# Altium schematic sheet main.SchDoc
size A4; SheetNumber: 1; SheetTotal: 4
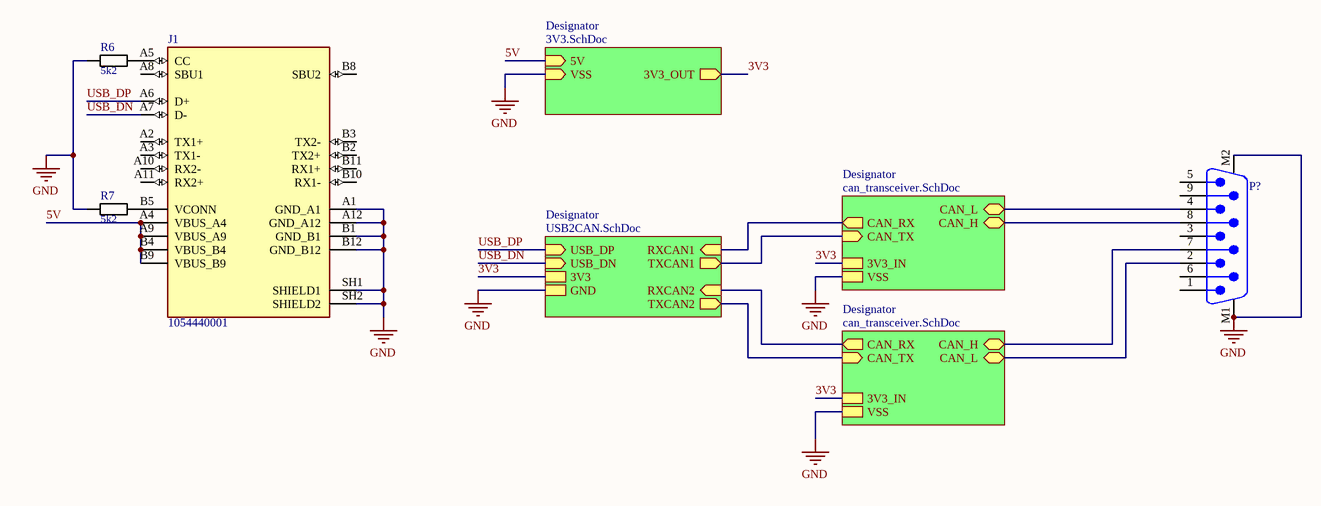
[diagram p0: main.SchDoc]

## Parts
J1  1054440001  [MOLEX_1054440001]
P?  618009211721  [618009211721]  (value not drawn)
R6  5k2  [0603_R]
R7  5k2  [0603_R]

## Sub-sheets
Designator = 3V3.SchDoc: VSS (in), 5V (in), 3V3_OUT (out)
Designator = USB2CAN.SchDoc: USB_DP (in), USB_DN (in), 3V3, GND, RXCAN1 (in), TXCAN1 (out), RXCAN2 (in), TXCAN2 (out)
Designator = can_transceiver.SchDoc: CAN_H (bidir), CAN_L (bidir), CAN_TX (in), CAN_RX (out), 3V3_IN, VSS
Designator = can_transceiver.SchDoc: CAN_H (bidir), CAN_L (bidir), CAN_TX (in), CAN_RX (out), 3V3_IN, VSS

## Nets
GND: J1.A1(GND_A1) J1.A12(GND_A12) J1.B1(GND_B1) J1.B12(GND_B12) J1.SH1(SHIELD1) J1.SH2(SHIELD2) P?.M1 P?.M2 R6.1 R7.1 ; sheet Designator/VSS, sheet Designator/GND, sheet Designator/VSS, sheet Designator/VSS
3V3: sheet Designator/3V3_OUT, sheet Designator/3V3, sheet Designator/3V3_IN, sheet Designator/3V3_IN
5V: J1.A4(VBUS_A4) J1.A9(VBUS_A9) J1.B4(VBUS_B4) J1.B9(VBUS_B9) ; sheet Designator/5V
USB_DN: J1.A7(D-) ; sheet Designator/USB_DN
USB_DP: J1.A6(D+) ; sheet Designator/USB_DP
NetJ1_A5: J1.A5(CC) R6.2
NetJ1_B5: J1.B5(VCONN) R7.2
NetP?_2: P?.2 ; sheet Designator/CAN_L
NetP?_4: P?.4 ; sheet Designator/CAN_L
NetP?_7: P?.7 ; sheet Designator/CAN_H
NetP?_8: P?.8 ; sheet Designator/CAN_H
(unnamed): sheet Designator/RXCAN1, sheet Designator/CAN_RX
(unnamed): sheet Designator/TXCAN1, sheet Designator/CAN_TX
(unnamed): sheet Designator/RXCAN2, sheet Designator/CAN_RX
(unnamed): sheet Designator/TXCAN2, sheet Designator/CAN_TX

Not connected (* = marked no-connect by the designer): J1 A2(TX1+) A3(TX1-) A8(SBU1) A10(RX2-) A11(RX2+) B2(TX2+) B3(TX2-) B8(SBU2) B10(RX1-) B11(RX1+); P? 1 3 5 6 9

## Library data of the parts
J1 = 1054440001: USB-C (USB TYPE-C) USB 3.2 Gen 2 (USB 3.1 Gen 2, Superspeed + (USB 3.1)) Plug Connector 24 Position Board Edge, Straddle Mount; MF: Molex; SnapEDA_Link: https://www.snapeda.com/parts/1054440001/Molex/view-part/?ref=snap; Package: None; Value: *; MP: 1054440001; Check_prices: https://www.snapeda.com/parts/1054440001/Molex/view-part/?ref=eda
P? = 618009211721: WR-DSUB 8.08mm Male PCB Connector without Hex Screw, Angled, 9p; Manufacturer: Wurth Elektronik; Contact Resistance: 30mOhm; Rated Current: 3A; Working Voltage: 125VAC; Withstanding Voltage: 1000VAC; Manufacturer Part Number: 618009211721; Category: Input/Output Connectors; Match Code: WR-DSUB; ComponentLink1Description: Website Link; ComponentLink1URL: https://www.we-online.com/redexpert/article/618009211721?ad; ComponentLink2Description: Datasheet Link; ComponentLink2URL: https://www.we-online.com/redexpert/spec/618009211721?ad; Mount: Through Hole; Operating Temperature Max: 105°C; Operating Temperature Min: -55°C; Packaging: Tray; Gender: Male; Number of Pins: 9; Orientation: Angled
R6 R7 = R_0603: R 0603, 75V, 0.1W; EBS_Nummer: %%%; HelpURL: %%%; Value: 5k2